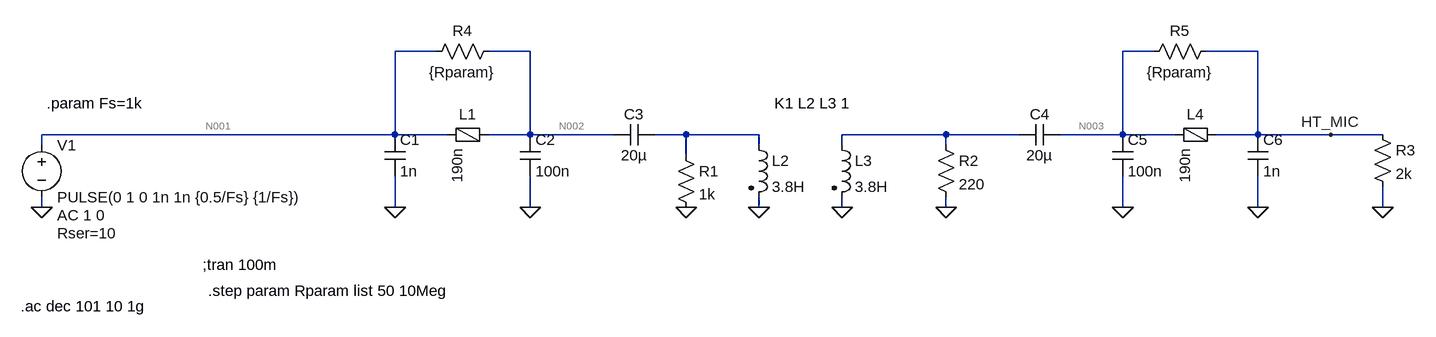
[diagram p0: schematic HT_MIC.asc]
HT_MIC.asc, the LTspice schematic file:
Version 4
SHEET 1 1752 680
WIRE 240 48 176 48
WIRE 384 48 320 48
WIRE 1344 48 1296 48
WIRE 1504 48 1424 48
WIRE 176 176 176 48
WIRE 176 176 -368 176
WIRE 256 176 176 176
WIRE 384 176 384 48
WIRE 384 176 320 176
WIRE 512 176 384 176
WIRE 624 176 576 176
WIRE 736 176 624 176
WIRE 1024 176 864 176
WIRE 1136 176 1024 176
WIRE 1296 176 1296 48
WIRE 1296 176 1200 176
WIRE 1376 176 1296 176
WIRE 1504 176 1504 48
WIRE 1504 176 1440 176
WIRE 1616 176 1504 176
WIRE 1696 176 1616 176
WIRE -368 192 -368 176
WIRE 736 192 736 176
WIRE 864 192 864 176
WIRE 1024 192 1024 176
WIRE 624 208 624 176
WIRE -368 288 -368 272
WIRE 176 288 176 240
WIRE 384 288 384 240
WIRE 736 288 736 272
WIRE 864 288 864 272
WIRE 1024 288 1024 272
WIRE 1296 288 1296 240
WIRE 1504 288 1504 240
WIRE 1696 288 1696 256
FLAG -368 288 0
FLAG 176 288 0
FLAG 384 288 0
FLAG 624 288 0
FLAG 736 288 0
FLAG 1296 288 0
FLAG 1504 288 0
FLAG 864 288 0
FLAG 1024 288 0
FLAG 1696 288 0
FLAG 1616 176 HT_MIC
SYMBOL voltage -368 176 R0
WINDOW 123 24 124 Left 2
WINDOW 39 24 152 Left 2
SYMATTR Value2 AC 1 0
SYMATTR SpiceLine Rser=10
SYMATTR InstName V1
SYMATTR Value PULSE(0 1 0 1n 1n {0.5/Fs} {1/Fs})
SYMBOL cap 160 176 R0
SYMATTR InstName C1
SYMATTR Value 1n
SYMBOL cap 368 176 R0
SYMATTR InstName C2
SYMATTR Value 100n
SYMBOL cap 576 160 R90
WINDOW 0 0 32 VBottom 2
WINDOW 3 32 32 VTop 2
SYMATTR InstName C3
SYMATTR Value 20µ
SYMBOL res 608 192 R0
SYMATTR InstName R1
SYMATTR Value 1k
SYMBOL ind2 720 176 R0
SYMATTR InstName L2
SYMATTR Value 3.8H
SYMATTR Type ind
SYMATTR SpiceLine Rser=115
SYMBOL ind2 848 176 R0
SYMATTR InstName L3
SYMATTR Value 3.8H
SYMATTR Type ind
SYMATTR SpiceLine Rser=115
SYMBOL res 1008 176 R0
SYMATTR InstName R2
SYMATTR Value 220
SYMBOL cap 1200 160 R90
WINDOW 0 0 32 VBottom 2
WINDOW 3 32 32 VTop 2
SYMATTR InstName C4
SYMATTR Value 20µ
SYMBOL cap 1280 176 R0
SYMATTR InstName C5
SYMATTR Value 100n
SYMBOL cap 1488 176 R0
SYMATTR InstName C6
SYMATTR Value 1n
SYMBOL res 1680 160 R0
SYMATTR InstName R3
SYMATTR Value 2k
SYMBOL FerriteBead 288 176 R90
WINDOW 0 -16 0 VBottom 2
SYMATTR InstName L1
SYMATTR Value 190n
SYMATTR SpiceLine Ipk=0.2 Rser=0.248 Rpar=500 Cpar=800f mfg="Würth Elektronik" pn="742792606 WE-CBF 0603"
SYMBOL res 336 32 R90
WINDOW 0 0 56 VBottom 2
WINDOW 3 32 56 VTop 2
SYMATTR InstName R4
SYMATTR Value {Rparam}
SYMBOL res 1440 32 R90
WINDOW 0 0 56 VBottom 2
WINDOW 3 32 56 VTop 2
SYMATTR InstName R5
SYMATTR Value {Rparam}
SYMBOL FerriteBead 1408 176 R90
WINDOW 0 -16 0 VBottom 2
SYMATTR InstName L4
SYMATTR Value 190n
SYMATTR SpiceLine Ipk=0.2 Rser=0.248 Rpar=500 Cpar=800f mfg="Würth Elektronik" pn="742792606 WE-CBF 0603"
TEXT 760 128 Left 2 !K1 L2 L3 1
TEXT -120 376 Left 2 !;tran 100m
TEXT -112 416 Left 2 !.step param Rparam list 50 10Meg
TEXT -360 128 Left 2 !.param Fs=1k
TEXT -400 440 Left 2 !.ac dec 101 10 1g

The netlist it stands for:
* HT_MIC.asc
V1 N001 0 PULSE(0 1 0 1n 1n {0.5/Fs} {1/Fs}) AC 1 0 Rser=10
C1 N001 0 1n
C2 N002 0 100n
C3 N004 N002 20µ
R1 N004 0 1k
L2 N004 0 3.8H Rser=115
L3 N005 0 3.8H Rser=115
R2 N005 0 220
C4 N003 N005 20µ
C5 N003 0 100n
C6 HT_MIC 0 1n
R3 HT_MIC 0 2k
L1 N002 N001 190n Ipk=0.2 Rser=0.248 Rpar=500 Cpar=800f mfg="Würth Elektronik" pn="742792606 WE-CBF 0603"
R4 N002 N001 {Rparam}
R5 HT_MIC N003 {Rparam}
L4 HT_MIC N003 190n Ipk=0.2 Rser=0.248 Rpar=500 Cpar=800f mfg="Würth Elektronik" pn="742792606 WE-CBF 0603"
K1 L2 L3 1
;tran 100m
.step param Rparam list 50 10Meg
.param Fs=1k
.ac dec 101 10 1g
.backanno
.end

* Results of the author's LTspice run, read from the files saved beside the schematic
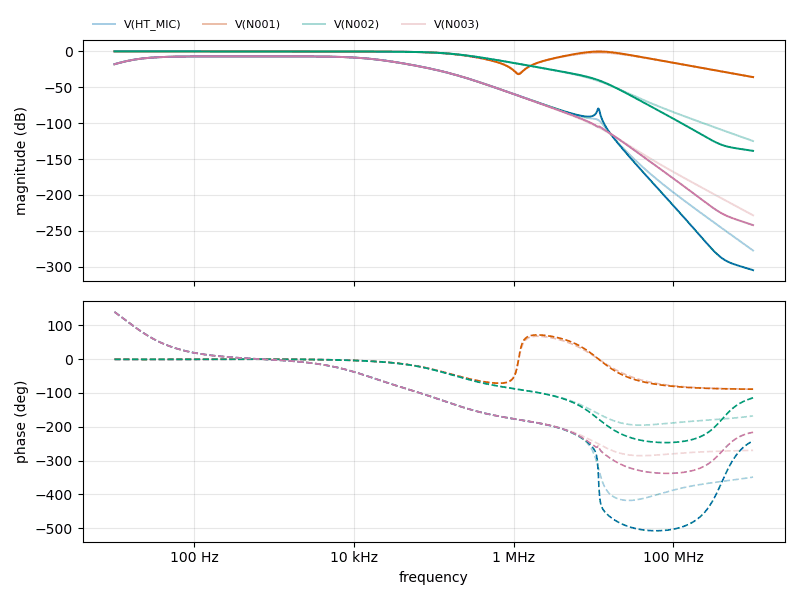
[diagram p1: AC Analysis of HT_MIC.asc, plotted from the saved traces]
* AC Analysis, 2 runs:
*   V(HT_MIC) [rparam=50]: -18.04 dB at 10 Hz, -277.28 dB at 1 GHz, peak -7.04 dB at 528.2 Hz, 3 dB below the peak at 22.35 Hz and 14.49 kHz
*   V(HT_MIC) [rparam=1e+007]: -18.04 dB at 10 Hz, -304.62 dB at 1 GHz, peak -7.04 dB at 528.2 Hz, 3 dB below the peak at 22.35 Hz and 14.49 kHz
*   V(N001) [rparam=50]: -0.03 dB at 10 Hz, -35.97 dB at 1 GHz, peak -0.03 dB at 10 Hz, 3 dB below the peak at 143.9 kHz
*   V(N001) [rparam=1e+007]: -0.03 dB at 10 Hz, -35.97 dB at 1 GHz, peak -0.03 dB at 10 Hz, 3 dB below the peak at 143.9 kHz
*   V(N002) [rparam=50]: -0.03 dB at 10 Hz, -124.93 dB at 1 GHz, peak -0.03 dB at 10 Hz, 3 dB below the peak at 148.6 kHz
*   V(N002) [rparam=1e+007]: -0.03 dB at 10 Hz, -138.60 dB at 1 GHz, peak -0.03 dB at 10 Hz, 3 dB below the peak at 148.6 kHz
*   V(N003) [rparam=50]: -18.04 dB at 10 Hz, -228.31 dB at 1 GHz, peak -7.04 dB at 528.2 Hz, 3 dB below the peak at 22.35 Hz and 14.49 kHz
*   V(N003) [rparam=1e+007]: -18.04 dB at 10 Hz, -241.98 dB at 1 GHz, peak -7.04 dB at 528.2 Hz, 3 dB below the peak at 22.35 Hz and 14.49 kHz